# Altium schematic sheet TUSB8041-Q1-4port Hub.SchDoc
size A3
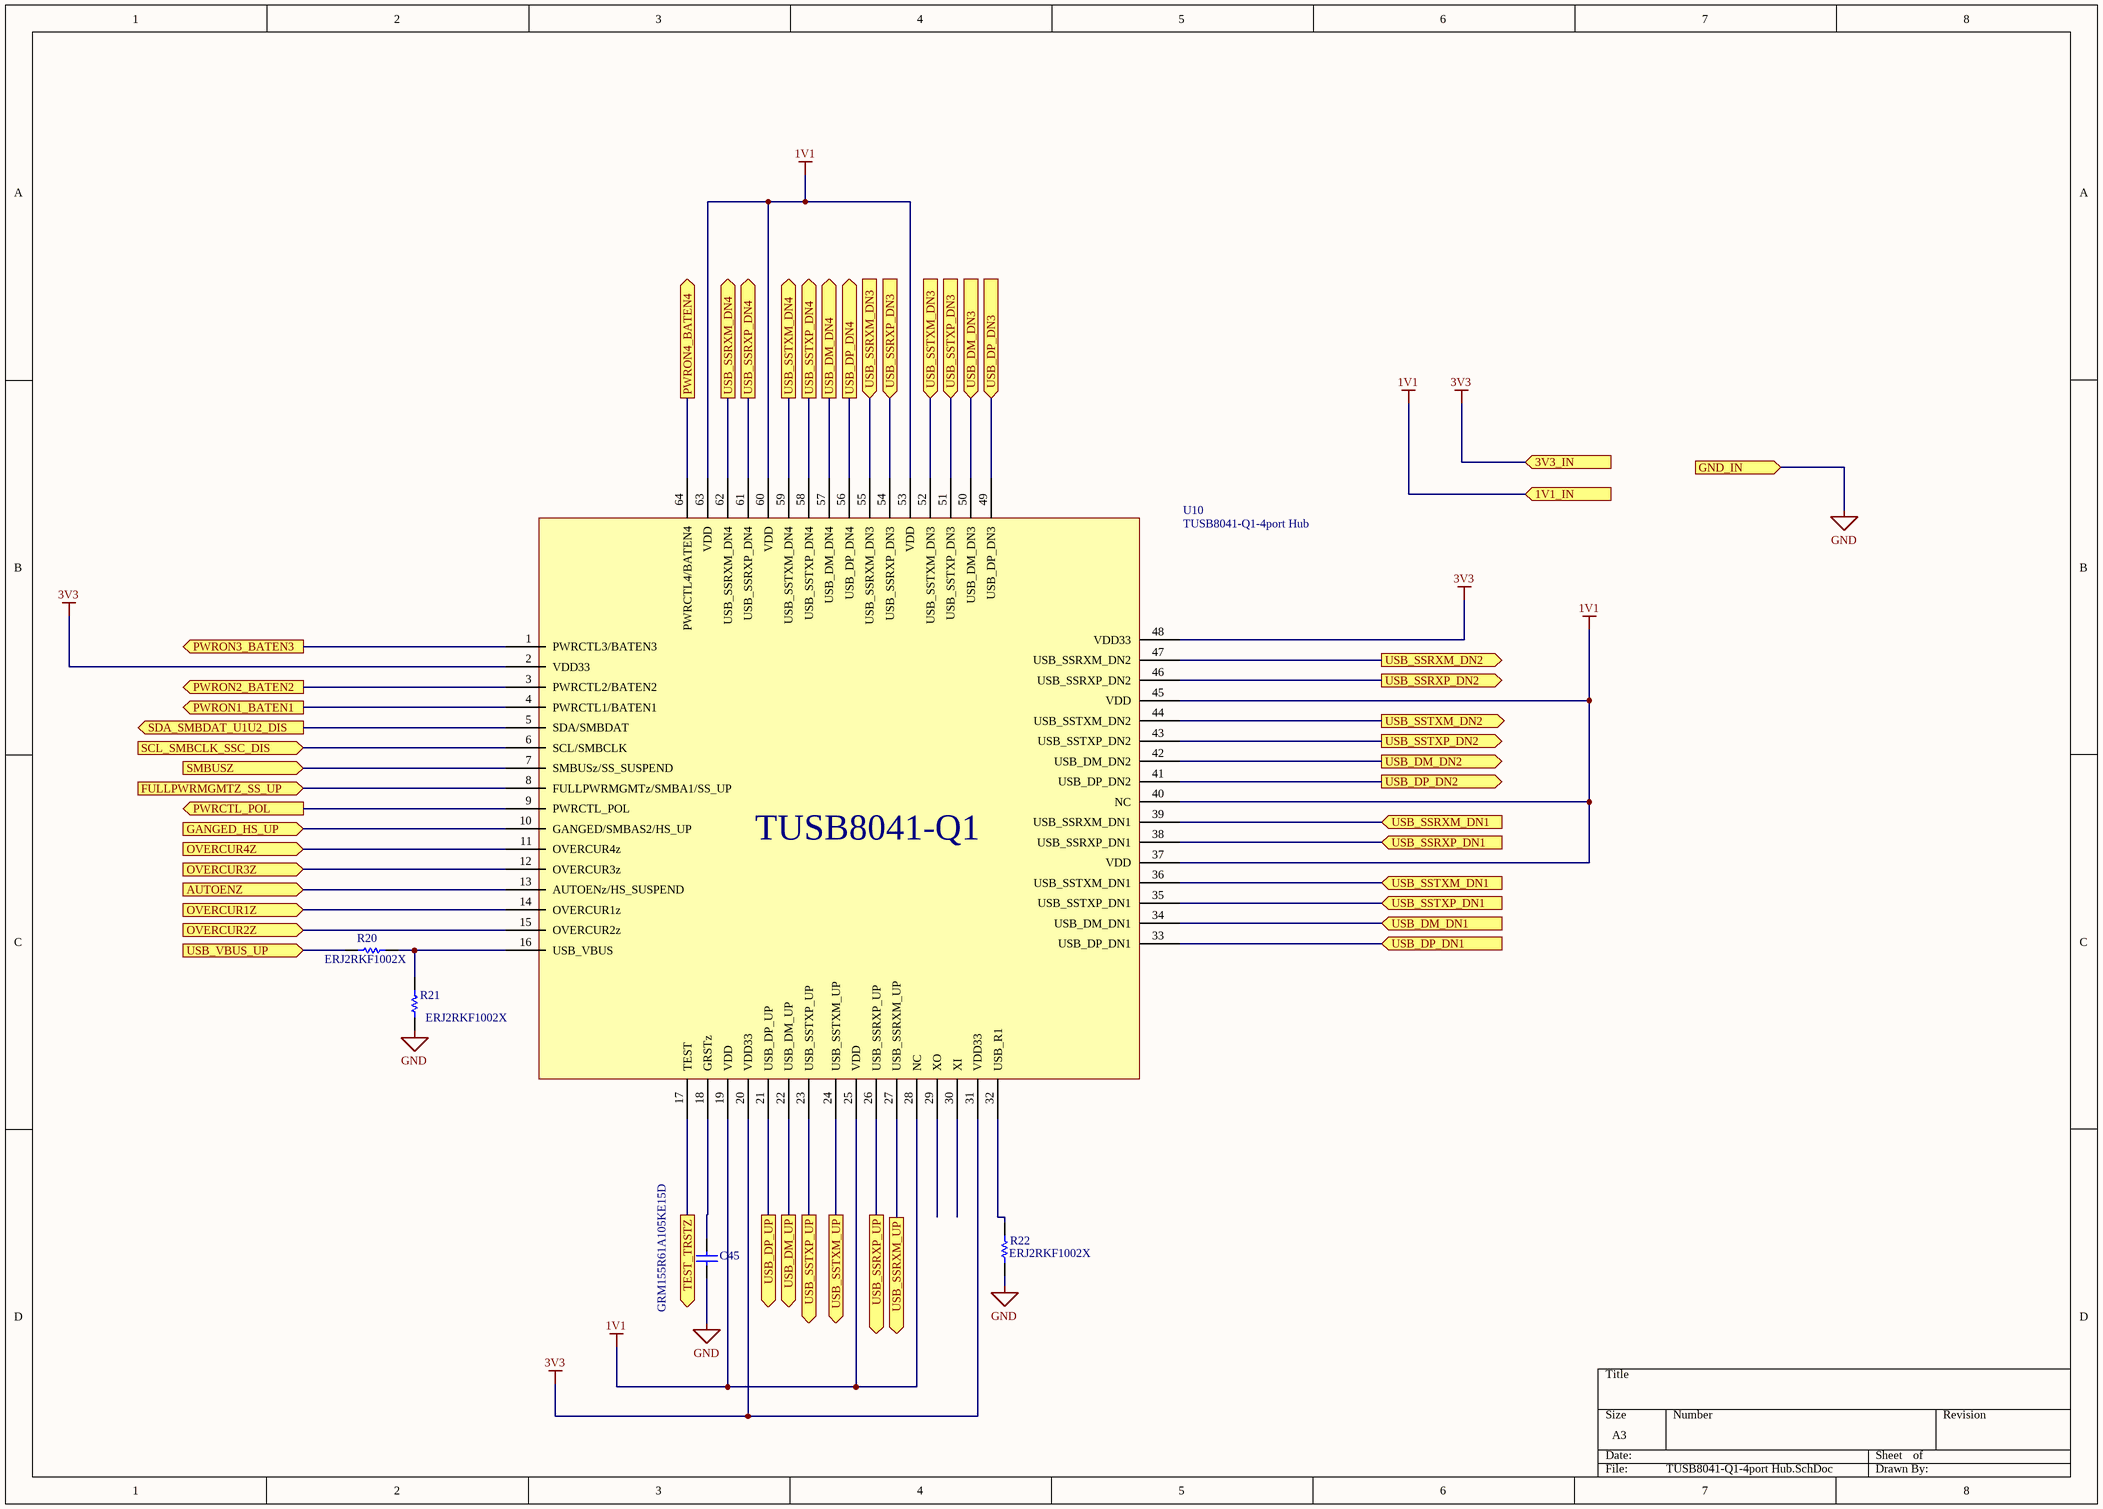
[diagram p0: TUSB8041-Q1-4port Hub.SchDoc]

## Parts
C45  GRM155R61A105KE15D  [CAPC1005X55X25NL05T10]
R20  ERJ2RKF1002X  [RESC1005X40X25LL05T05]
R21  ERJ2RKF1002X  [RESC1005X40X25LL05T05]
R22  ERJ2RKF1002X  [RESC1005X40X25LL05T05]
U10  TUSB8041-Q1-4port Hub  [TSQFP50P1200X1200X120-64N]

## Ports
1V1_IN (in), 3V3_IN (in), AUTOENZ (in), FULLPWRMGMTZ_SS_UP (in), GANGED_HS_UP (in), GND_IN (in), OVERCUR1Z (in), OVERCUR2Z (in), OVERCUR3Z (in), OVERCUR4Z (in), PWRCTL_POL (out), PWRON1_BATEN1 (out), PWRON2_BATEN2 (out), PWRON3_BATEN3 (out), PWRON4_BATEN4 (out), SCL_SMBCLK_SSC_DIS (in), SDA_SMBDAT_U1U2_DIS (out), SMBUSZ (in), TEST_TRSTZ (out), USB_DM_DN1 (in), USB_DM_DN2 (out), USB_DM_DN3 (in), USB_DM_DN4 (out), USB_DM_UP (out), USB_DP_DN1 (in), USB_DP_DN2 (out), USB_DP_DN3 (in), USB_DP_DN4 (out), USB_DP_UP (out), USB_SSRXM_DN1 (in), USB_SSRXM_DN2 (out), USB_SSRXM_DN3 (in), USB_SSRXM_DN4 (out), USB_SSRXM_UP (out), USB_SSRXP_DN1 (in), USB_SSRXP_DN2 (out), USB_SSRXP_DN3 (in), USB_SSRXP_DN4 (out), USB_SSRXP_UP (out), USB_SSTXM_DN1 (in), USB_SSTXM_DN2 (out), USB_SSTXM_DN3 (in), USB_SSTXM_DN4 (out), USB_SSTXM_UP (out), USB_SSTXP_DN1 (in), USB_SSTXP_DN2 (out), USB_SSTXP_DN3 (in), USB_SSTXP_DN4 (out), USB_SSTXP_UP (out), USB_VBUS_UP (in)

## Nets
1V1: U10.19(VDD) U10.25(VDD) U10.28(NC) U10.37(VDD) U10.40(NC) U10.45(VDD) U10.53(VDD) U10.60(VDD) U10.63(VDD) ; port 1V1_IN
3V3: U10.2(VDD33) U10.20(VDD33) U10.31(VDD33) U10.48(VDD33) ; port 3V3_IN
GND: C45.1 R21.1 R22.1 ; port GND_IN
AUTOENZ: U10.13(AUTOENz/HS_SUSPEND) ; port AUTOENZ
FULLPWRMGMTZ_SS_UP: U10.8(FULLPWRMGMTz/SMBA1/SS_UP) ; port FULLPWRMGMTZ_SS_UP
GANGED_HS_UP: U10.10(GANGED/SMBAS2/HS_UP) ; port GANGED_HS_UP
OVERCUR1Z: U10.14(OVERCUR1z) ; port OVERCUR1Z
OVERCUR2Z: U10.15(OVERCUR2z) ; port OVERCUR2Z
OVERCUR3Z: U10.12(OVERCUR3z) ; port OVERCUR3Z
OVERCUR4Z: U10.11(OVERCUR4z) ; port OVERCUR4Z
PWRCTL_POL: U10.9(PWRCTL_POL) ; port PWRCTL_POL
PWRON1_BATEN1: U10.4(PWRCTL1/BATEN1) ; port PWRON1_BATEN1
PWRON2_BATEN2: U10.3(PWRCTL2/BATEN2) ; port PWRON2_BATEN2
PWRON3_BATEN3: U10.1(PWRCTL3/BATEN3) ; port PWRON3_BATEN3
PWRON4_BATEN4: U10.64(PWRCTL4/BATEN4) ; port PWRON4_BATEN4
SCL_SMBCLK_SSC_DIS: U10.6(SCL/SMBCLK) ; port SCL_SMBCLK_SSC_DIS
SDA_SMBDAT_U1U2_DIS: U10.5(SDA/SMBDAT) ; port SDA_SMBDAT_U1U2_DIS
SMBUSZ: U10.7(SMBUSz/SS_SUSPEND) ; port SMBUSZ
TEST_TRSTZ: U10.17(TEST) ; port TEST_TRSTZ
USB_DM_DN1: U10.34(USB_DM_DN1) ; port USB_DM_DN1
USB_DM_DN2: U10.42(USB_DM_DN2) ; port USB_DM_DN2
USB_DM_DN3: U10.50(USB_DM_DN3) ; port USB_DM_DN3
USB_DM_DN4: U10.57(USB_DM_DN4) ; port USB_DM_DN4
USB_DM_UP: U10.22(USB_DM_UP) ; port USB_DM_UP
USB_DP_DN1: U10.33(USB_DP_DN1) ; port USB_DP_DN1
USB_DP_DN2: U10.41(USB_DP_DN2) ; port USB_DP_DN2
USB_DP_DN3: U10.49(USB_DP_DN3) ; port USB_DP_DN3
USB_DP_DN4: U10.56(USB_DP_DN4) ; port USB_DP_DN4
USB_DP_UP: U10.21(USB_DP_UP) ; port USB_DP_UP
USB_SSRXM_DN1: U10.39(USB_SSRXM_DN1) ; port USB_SSRXM_DN1
USB_SSRXM_DN2: U10.47(USB_SSRXM_DN2) ; port USB_SSRXM_DN2
USB_SSRXM_DN3: U10.55(USB_SSRXM_DN3) ; port USB_SSRXM_DN3
USB_SSRXM_DN4: U10.62(USB_SSRXM_DN4) ; port USB_SSRXM_DN4
USB_SSRXM_UP: U10.27(USB_SSRXM_UP) ; port USB_SSRXM_UP
USB_SSRXP_DN1: U10.38(USB_SSRXP_DN1) ; port USB_SSRXP_DN1
USB_SSRXP_DN2: U10.46(USB_SSRXP_DN2) ; port USB_SSRXP_DN2
USB_SSRXP_DN3: U10.54(USB_SSRXP_DN3) ; port USB_SSRXP_DN3
USB_SSRXP_DN4: U10.61(USB_SSRXP_DN4) ; port USB_SSRXP_DN4
USB_SSRXP_UP: U10.26(USB_SSRXP_UP) ; port USB_SSRXP_UP
USB_SSTXM_DN1: U10.36(USB_SSTXM_DN1) ; port USB_SSTXM_DN1
USB_SSTXM_DN2: U10.44(USB_SSTXM_DN2) ; port USB_SSTXM_DN2
USB_SSTXM_DN3: U10.52(USB_SSTXM_DN3) ; port USB_SSTXM_DN3
USB_SSTXM_DN4: U10.59(USB_SSTXM_DN4) ; port USB_SSTXM_DN4
USB_SSTXM_UP: U10.24(USB_SSTXM_UP) ; port USB_SSTXM_UP
USB_SSTXP_DN1: U10.35(USB_SSTXP_DN1) ; port USB_SSTXP_DN1
USB_SSTXP_DN2: U10.43(USB_SSTXP_DN2) ; port USB_SSTXP_DN2
USB_SSTXP_DN3: U10.51(USB_SSTXP_DN3) ; port USB_SSTXP_DN3
USB_SSTXP_DN4: U10.58(USB_SSTXP_DN4) ; port USB_SSTXP_DN4
USB_SSTXP_UP: U10.23(USB_SSTXP_UP) ; port USB_SSTXP_UP
USB_VBUS_UP: R20.2 ; port USB_VBUS_UP
NetC45_2: C45.2 U10.18(GRSTz)
NetR20_1: R20.1 R21.2 U10.16(USB_VBUS)
NetR22_2: R22.2 U10.32(USB_R1)

Not connected (* = marked no-connect by the designer): U10 29(XO) 30(XI)

## Notes on the sheet
- (in symbol TUSB8041-Q1-4port Hub) TUSB8041-Q1

## Library data of the parts
C45 = CMP-2008-04556-1: Manufacturer: Murata; Part Number: GRM155R61A105KE15D
R20-R22 = CMP-2000-07588-1: Chip Resistor, 10 KOhm, +/- 1%, 0.1 W, -55 to 155 degC, 0402 (1005 Metric), RoHS, Tape and Reel; Manufacturer: Panasonic; Power Rating: 100mW; Voltage Rating: 50V; Resistance: 10KOhm; Case\/Package: 0402; Temperature Coefficient: 100ppm\/degreesC; RoHSCompliant: True; Lead Free: LeadFree; Package Quantity: 1; Contact Plating: Tin; Length: 1mm; Radiation Hardening: No; REACH SVHC: NoSVHC; Max Operating Temperature: 155degC; Depth: 0.5mm; Case Code (Imperial): 0402; Military Standard: Not; Package Description: 2-Pin Surface Mount Device, Body 1 x 0.5 mm; Termination: SMD/SMT; Case Code (Metric): 1005; Height: 0.35mm; Packaging: TapeandReel; Voltage Rating (DC): 50V; Package Reference: 402; Number of Pins: 2; Tolerance: 1%; Mounting Technology: SurfaceMount; Width: 0.02inch; Mount: SurfaceMount; Datasheet URL: https://industrial.panasonic.com/cdbs/www-data/pdf/RDA0000/AOA0000C304.pdf; Composition: ThickFilm; Datasheet Version: 02/2017; Manufacturer URL: http://www.panasonic.com/; Max Power Dissipation: 100mW; Number of Terminations: 2; Min Operating Temperature: -55degC